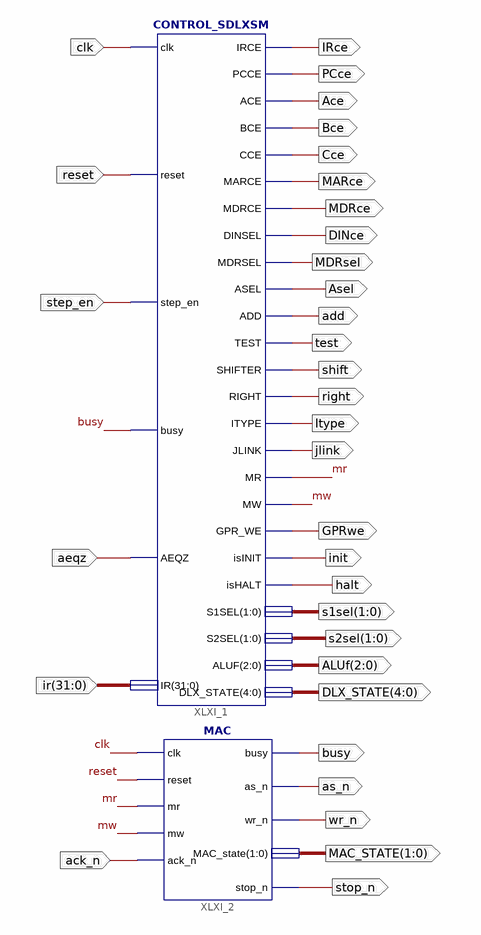
[diagram p0: schematic sheet 1]
// Xilinx ISE schematic control_unit.sch (artix7) as structural Verilog: 2 symbols, 34 ports
module control_unit (
  input  clk,
  input  reset,
  input  step_en,
  input  aeqz,
  input  [31:0] ir,
  input  ack_n,
  output busy,
  output IRce,
  output PCce,
  output Ace,
  output Bce,
  output Cce,
  output MARce,
  output MDRce,
  output DINce,
  output MDRsel,
  output Asel,
  output add,
  output test,
  output shift,
  output right,
  output Itype,
  output jlink,
  output GPRwe,
  output init,
  output halt,
  output [1:0] s1sel,
  output [1:0] s2sel,
  output [2:0] ALUf,
  output [4:0] DLX_STATE,
  output wr_n,
  output [1:0] MAC_STATE,
  output stop_n,
  output as_n
);

  wire mr, mw;

  CONTROL_SDLXSM XLXI_1 (
    .clk(clk), .reset(reset), .step_en(step_en), .busy(busy), .AEQZ(aeqz), .IR(ir), .IRCE(IRce), .PCCE(PCce),
    .ACE(Ace), .BCE(Bce), .CCE(Cce), .MARCE(MARce), .MDRCE(MDRce), .DINSEL(DINce), .MDRSEL(MDRsel),
    .ASEL(Asel), .ADD(add), .TEST(test), .SHIFTER(shift), .RIGHT(right), .ITYPE(Itype), .JLINK(jlink),
    .MR(mr), .MW(mw), .GPR_WE(GPRwe), .isINIT(init), .isHALT(halt), .S1SEL(s1sel), .S2SEL(s2sel),
    .ALUF(ALUf), .DLX_STATE(DLX_STATE));
  MAC XLXI_2 (
    .ack_n(ack_n), .clk(clk), .mr(mr), .mw(mw), .reset(reset), .as_n(as_n), .busy(busy), .wr_n(wr_n),
    .MAC_state(MAC_STATE), .stop_n(stop_n));
endmodule
